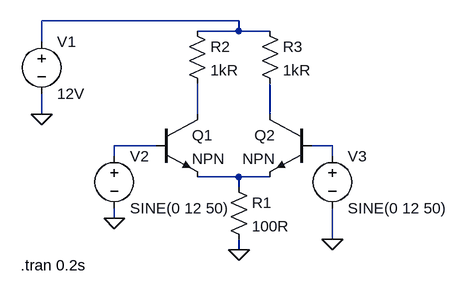
[diagram p0: schematic differential_amp.asc]
differential_amp.asc, the LTspice schematic file:
Version 4
SHEET 1 880 680
WIRE 224 0 -80 0
WIRE 224 16 224 0
WIRE 224 16 160 16
WIRE 272 16 224 16
WIRE -80 32 -80 0
WIRE -80 144 -80 112
WIRE 160 144 160 96
WIRE 272 144 272 96
WIRE 96 192 32 192
WIRE 368 192 336 192
WIRE 32 208 32 192
WIRE 368 208 368 192
WIRE 224 240 160 240
WIRE 272 240 224 240
WIRE 224 256 224 240
WIRE 32 304 32 288
WIRE 368 336 368 288
WIRE 224 352 224 336
FLAG 224 352 0
FLAG -80 144 0
FLAG 32 304 0
FLAG 368 336 0
SYMBOL npn 96 144 R0
SYMATTR InstName Q1
SYMBOL npn 336 144 M0
SYMATTR InstName Q2
SYMBOL res 208 240 R0
SYMATTR InstName R1
SYMATTR Value 100R
SYMBOL res 144 0 R0
SYMATTR InstName R2
SYMATTR Value 1kR
SYMBOL res 256 0 R0
SYMATTR InstName R3
SYMATTR Value 1kR
SYMBOL voltage -80 16 R0
WINDOW 123 0 0 Left 0
WINDOW 39 0 0 Left 0
SYMATTR InstName V1
SYMATTR Value 12V
SYMBOL voltage 32 192 R0
WINDOW 123 0 0 Left 0
WINDOW 39 0 0 Left 0
SYMATTR InstName V2
SYMATTR Value SINE(0 12 50)
SYMBOL voltage 368 192 R0
WINDOW 123 0 0 Left 0
WINDOW 39 0 0 Left 0
SYMATTR InstName V3
SYMATTR Value SINE(0 12 50)
TEXT -112 376 Left 2 !.tran 0.2s

The netlist it stands for:
* differential_amp.asc
Q1 N002 N004 N006 0 NPN
Q2 N003 N005 N006 0 NPN
R1 N006 0 100R
R2 N001 N002 1kR
R3 N001 N003 1kR
V1 N001 0 12V
V2 N004 0 SINE(0 12 50)
V3 N005 0 SINE(0 12 50)
.model NPN NPN
.model PNP PNP
.lib standard.bjt
.tran 0.2s
.backanno
.end